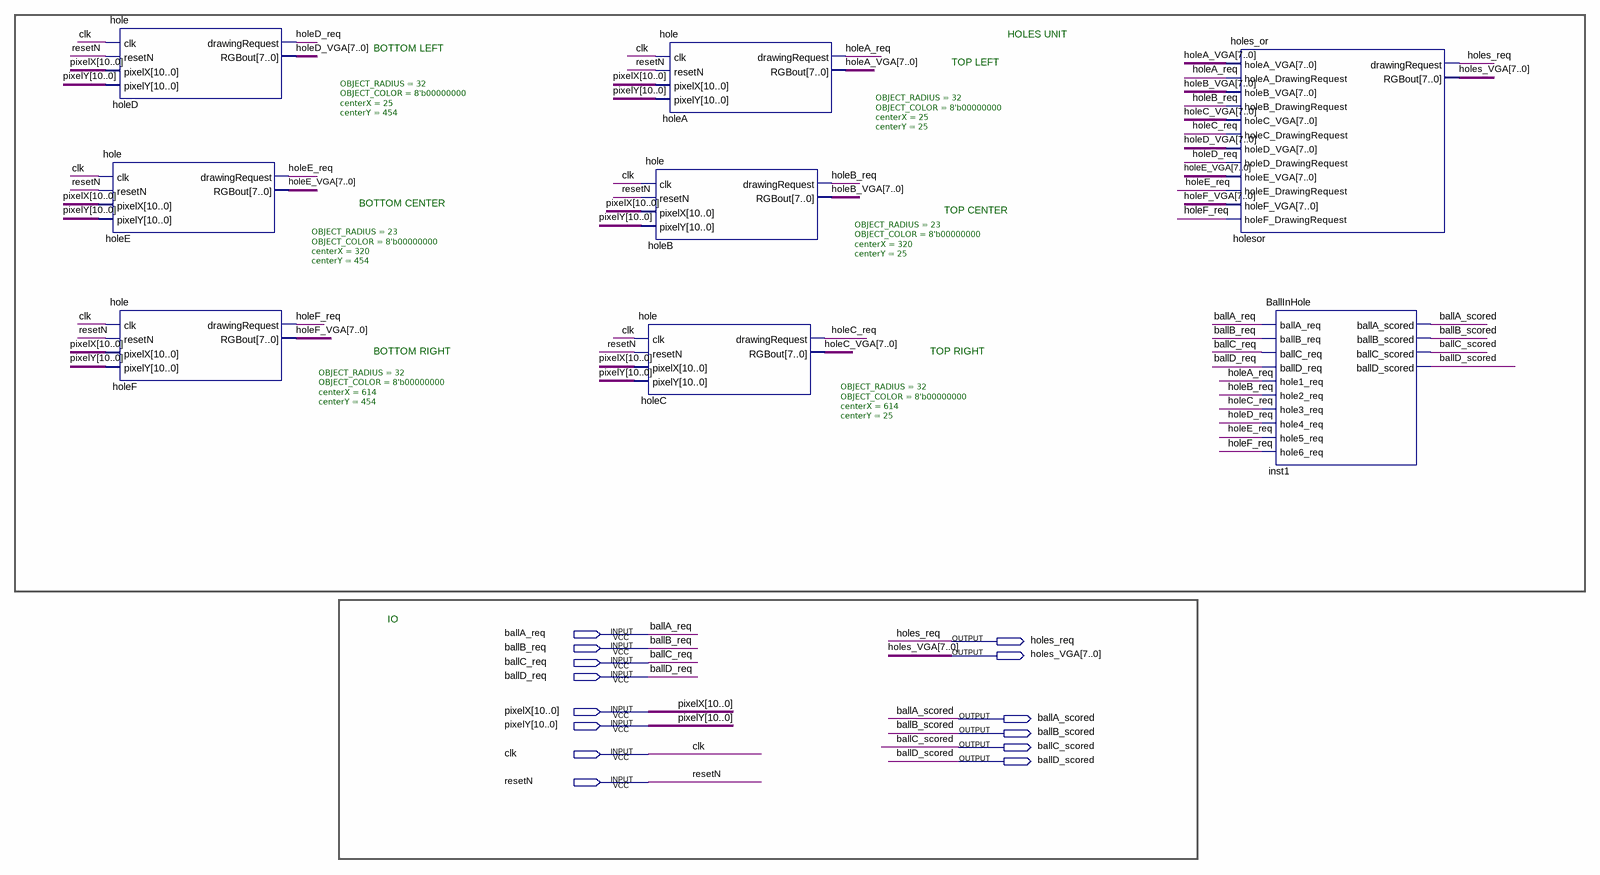
[diagram p0: schematic sheet]
// Quartus schematic HOLES_TOP.bdf as structural Verilog: 8 symbols, 14 pins
module HOLES_TOP (
  input  ballA_req,
  input  ballB_req,
  input  ballC_req,
  input  ballD_req,
  input  [10:0] pixelX,
  input  [10:0] pixelY,
  input  clk,
  input  resetN,
  output holes_req,
  output [7:0] holes_VGA,
  output ballA_scored,
  output ballB_scored,
  output ballC_scored,
  output ballD_scored
);

  wire holeA_req, holeB_req, holeC_req, holeD_req, holeE_req, holeF_req;
  wire [7:0] holeA_VGA, holeB_VGA, holeC_VGA, holeD_VGA, holeE_VGA, holeF_VGA;

  hole #(.OBJECT_RADIUS(32), .OBJECT_COLOR(8'b00000000), .centerX(25), .centerY(454)) holeD (
    .clk(clk), .resetN(resetN), .pixelX(pixelX), .pixelY(pixelY), .drawingRequest(holeD_req),
    .RGBout(holeD_VGA));
  hole #(.OBJECT_RADIUS(23), .OBJECT_COLOR(8'b00000000), .centerX(320), .centerY(454)) holeE (
    .clk(clk), .resetN(resetN), .pixelX(pixelX), .pixelY(pixelY), .drawingRequest(holeE_req),
    .RGBout(holeE_VGA));
  hole #(.OBJECT_RADIUS(32), .OBJECT_COLOR(8'b00000000), .centerX(614), .centerY(454)) holeF (
    .clk(clk), .resetN(resetN), .pixelX(pixelX), .pixelY(pixelY), .drawingRequest(holeF_req),
    .RGBout(holeF_VGA));
  hole #(.OBJECT_RADIUS(32), .OBJECT_COLOR(8'b00000000), .centerX(614), .centerY(25)) holeC (
    .clk(clk), .resetN(resetN), .pixelX(pixelX), .pixelY(pixelY), .drawingRequest(holeC_req),
    .RGBout(holeC_VGA));
  hole #(.OBJECT_RADIUS(32), .OBJECT_COLOR(8'b00000000), .centerX(25), .centerY(25)) holeA (
    .clk(clk), .resetN(resetN), .pixelX(pixelX), .pixelY(pixelY), .drawingRequest(holeA_req),
    .RGBout(holeA_VGA));
  hole #(.OBJECT_RADIUS(23), .OBJECT_COLOR(8'b00000000), .centerX(320), .centerY(25)) holeB (
    .clk(clk), .resetN(resetN), .pixelX(pixelX), .pixelY(pixelY), .drawingRequest(holeB_req),
    .RGBout(holeB_VGA));
  holes_or holesor (
    .holeA_VGA(holeA_VGA), .holeA_DrawingRequest(holeA_req), .holeB_VGA(holeB_VGA),
    .holeB_DrawingRequest(holeB_req), .holeC_VGA(holeC_VGA), .holeC_DrawingRequest(holeC_req),
    .holeD_VGA(holeD_VGA), .holeD_DrawingRequest(holeD_req), .holeE_VGA(holeE_VGA),
    .holeE_DrawingRequest(holeE_req), .holeF_VGA(holeF_VGA), .holeF_DrawingRequest(holeF_req),
    .drawingRequest(holes_req), .RGBout(holes_VGA));
  BallInHole inst1 (
    .ballA_req(ballA_req), .ballB_req(ballB_req), .ballC_req(ballC_req), .ballD_req(ballD_req),
    .hole1_req(holeA_req), .hole2_req(holeB_req), .hole3_req(holeC_req), .hole4_req(holeD_req),
    .hole5_req(holeE_req), .hole6_req(holeF_req), .ballA_scored(ballA_scored), .ballB_scored(ballB_scored),
    .ballC_scored(ballC_scored), .ballD_scored(ballD_scored));

  // Notes on the sheet:
  //   HOLES UNIT
  //   BOTTOM LEFT
  //   TOP LEFT
  //   BOTTOM CENTER
  //   TOP CENTER
  //   BOTTOM RIGHT
  //   TOP RIGHT
  //   IO
endmodule
